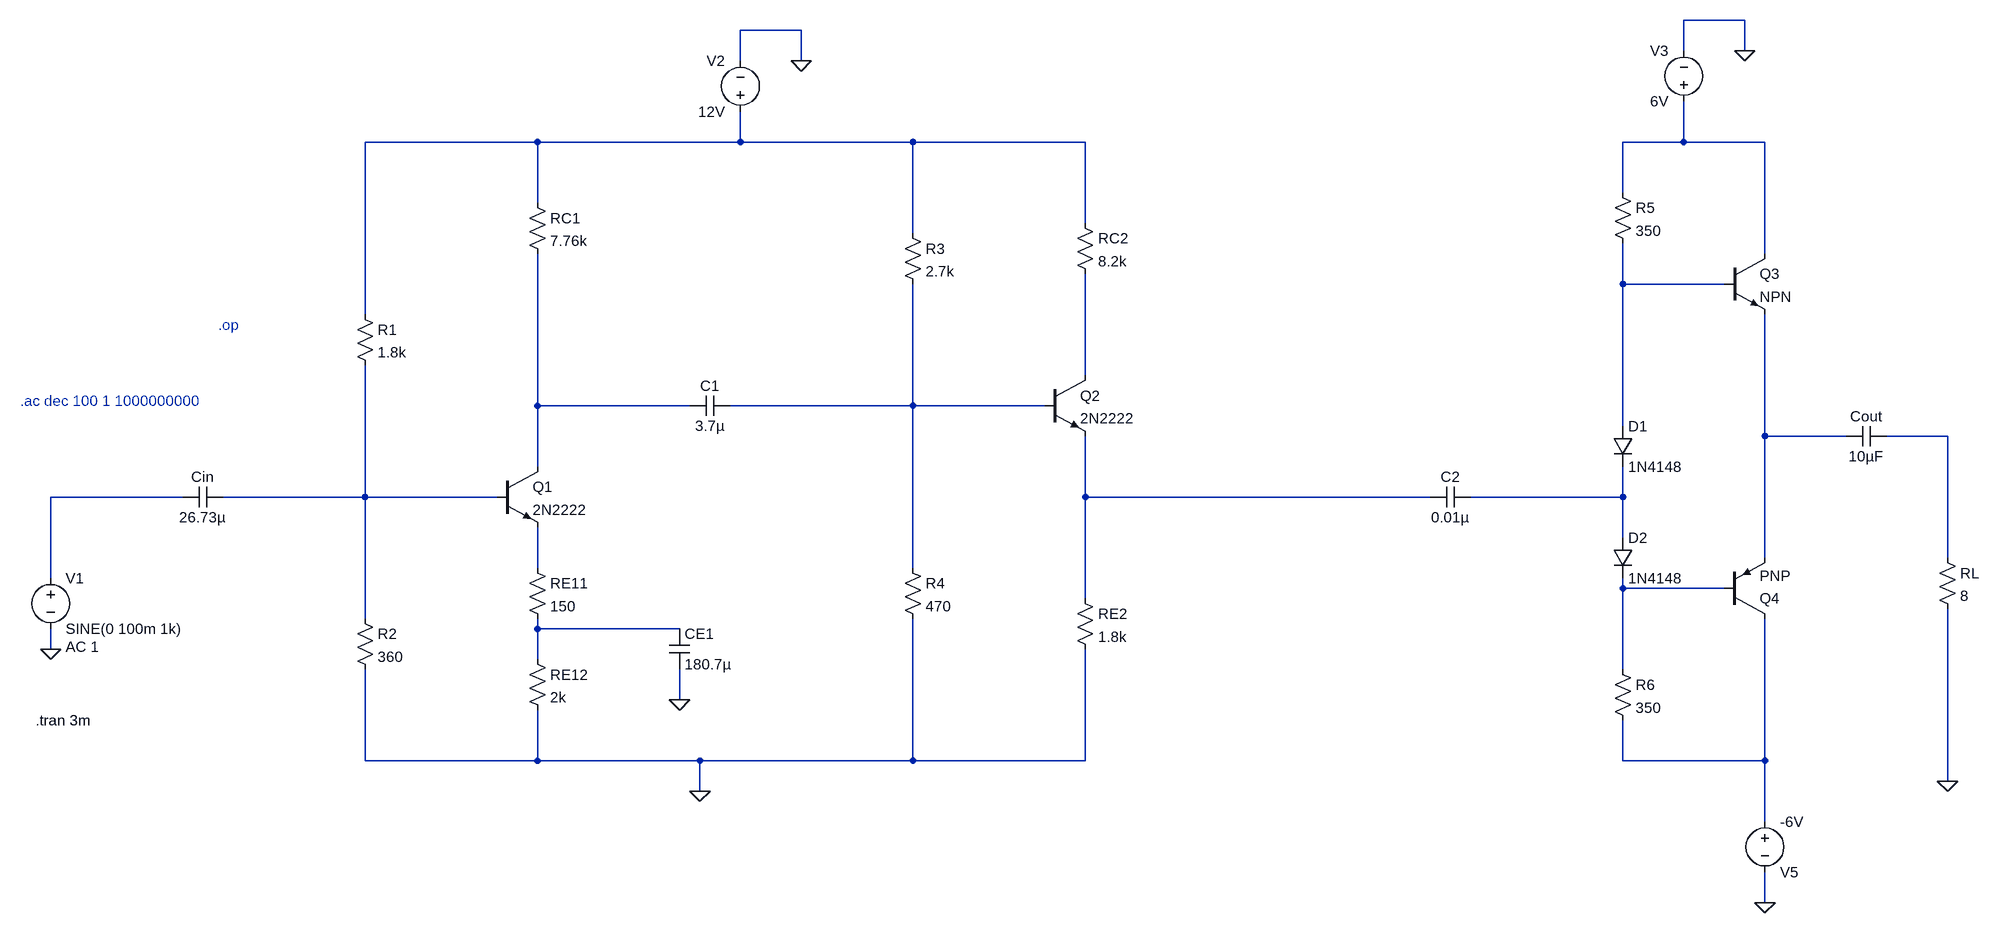
[diagram p0: schematic btlmdt_2stage.asc]
btlmdt_2stage.asc, the LTspice schematic file:
Version 4.1
SHEET 1 4068 680
WIRE 2784 -752 2688 -752
WIRE 1296 -736 1200 -736
WIRE 2688 -704 2688 -752
WIRE 2784 -704 2784 -752
WIRE 1200 -688 1200 -736
WIRE 1296 -688 1296 -736
WIRE 880 -560 608 -560
WIRE 1200 -560 1200 -608
WIRE 1200 -560 880 -560
WIRE 1472 -560 1200 -560
WIRE 1744 -560 1472 -560
WIRE 2688 -560 2688 -624
WIRE 2688 -560 2592 -560
WIRE 2816 -560 2688 -560
WIRE 2592 -480 2592 -560
WIRE 880 -464 880 -560
WIRE 1744 -432 1744 -560
WIRE 1472 -416 1472 -560
WIRE 2816 -384 2816 -560
WIRE 2592 -336 2592 -400
WIRE 2752 -336 2592 -336
WIRE 608 -288 608 -560
WIRE 1744 -192 1744 -352
WIRE 880 -144 880 -384
WIRE 1120 -144 880 -144
WIRE 1472 -144 1472 -336
WIRE 1472 -144 1184 -144
WIRE 1680 -144 1472 -144
WIRE 2592 -112 2592 -336
WIRE 2816 -96 2816 -288
WIRE 2944 -96 2816 -96
WIRE 3104 -96 3008 -96
WIRE 880 -48 880 -144
WIRE 320 0 112 0
WIRE 608 0 608 -208
WIRE 608 0 384 0
WIRE 816 0 608 0
WIRE 1744 0 1744 -96
WIRE 2288 0 1744 0
WIRE 2592 0 2592 -48
WIRE 2592 0 2352 0
WIRE 2592 64 2592 0
WIRE 2816 96 2816 -96
WIRE 3104 96 3104 -96
WIRE 880 112 880 48
WIRE 1472 112 1472 -144
WIRE 112 128 112 0
WIRE 2592 144 2592 128
WIRE 2752 144 2592 144
WIRE 1744 160 1744 0
WIRE 608 192 608 0
WIRE 880 208 880 192
WIRE 1104 208 880 208
WIRE 112 240 112 208
WIRE 880 256 880 208
WIRE 2592 272 2592 144
WIRE 1104 320 1104 272
WIRE 608 416 608 272
WIRE 880 416 880 336
WIRE 880 416 608 416
WIRE 1136 416 880 416
WIRE 1472 416 1472 192
WIRE 1472 416 1136 416
WIRE 1744 416 1744 240
WIRE 1744 416 1472 416
WIRE 2592 416 2592 352
WIRE 2816 416 2816 192
WIRE 2816 416 2592 416
WIRE 3104 448 3104 176
WIRE 1136 464 1136 416
WIRE 2816 512 2816 416
WIRE 2816 640 2816 592
FLAG 1136 464 0
FLAG 1296 -688 0
FLAG 1104 320 0
FLAG 112 240 0
FLAG 2784 -704 0
FLAG 2816 640 0
FLAG 3104 448 0
SYMBOL voltage 112 112 R0
WINDOW 123 24 124 Left 2
WINDOW 39 0 0 Left 0
SYMATTR Value2 AC 1
SYMATTR InstName V1
SYMATTR Value SINE(0 100m 1k)
SYMBOL cap 1088 208 R0
SYMATTR InstName CE1
SYMATTR Value 180.7µ
SYMBOL cap 384 -16 R90
WINDOW 0 0 32 VBottom 2
WINDOW 3 32 32 VTop 2
SYMATTR InstName Cin
SYMATTR Value 26.73µ
SYMBOL res 592 176 R0
SYMATTR InstName R2
SYMATTR Value 360
SYMBOL res 864 -480 R0
SYMATTR InstName RC1
SYMATTR Value 7.76k
SYMBOL res 1456 -432 R0
SYMATTR InstName R3
SYMATTR Value 2.7k
SYMBOL res 592 -304 R0
SYMATTR InstName R1
SYMATTR Value 1.8k
SYMBOL res 1728 -448 R0
SYMATTR InstName RC2
SYMATTR Value 8.2k
SYMBOL res 1728 144 R0
SYMATTR InstName RE2
SYMATTR Value 1.8k
SYMBOL res 1456 96 R0
SYMATTR InstName R4
SYMATTR Value 470
SYMBOL res 864 240 R0
SYMATTR InstName RE12
SYMATTR Value 2k
SYMBOL npn 816 -48 R0
SYMATTR InstName Q1
SYMATTR Value 2N2222
SYMBOL npn 1680 -192 R0
SYMATTR InstName Q2
SYMATTR Value 2N2222
SYMBOL voltage 1200 -592 R180
WINDOW 0 24 96 Left 2
WINDOW 3 24 16 Left 2
WINDOW 123 0 0 Left 0
WINDOW 39 0 0 Left 0
SYMATTR InstName V2
SYMATTR Value 12V
SYMBOL npn 2752 -384 R0
SYMATTR InstName Q3
SYMBOL res 2576 -496 R0
SYMATTR InstName R5
SYMATTR Value 350
SYMBOL res 2576 256 R0
SYMATTR InstName R6
SYMATTR Value 350
SYMBOL res 3088 80 R0
SYMATTR InstName RL
SYMATTR Value 8
SYMBOL pnp 2752 192 M180
SYMATTR InstName Q4
SYMBOL cap 2352 -16 R90
WINDOW 0 0 32 VBottom 2
WINDOW 3 32 32 VTop 2
SYMATTR InstName C2
SYMATTR Value 0.01µ
SYMBOL cap 3008 -112 R90
WINDOW 0 0 32 VBottom 2
WINDOW 3 32 32 VTop 2
SYMATTR InstName Cout
SYMATTR Value 10µF
SYMBOL diode 2576 -112 R0
SYMATTR InstName D1
SYMATTR Value 1N4148
SYMBOL diode 2576 64 R0
SYMATTR InstName D2
SYMATTR Value 1N4148
SYMBOL res 864 96 R0
SYMATTR InstName RE11
SYMATTR Value 150
SYMBOL cap 1184 -160 R90
WINDOW 0 0 32 VBottom 2
WINDOW 3 32 32 VTop 2
SYMATTR InstName C1
SYMATTR Value 3.7µ
SYMBOL voltage 2688 -608 R180
WINDOW 0 24 96 Left 2
WINDOW 3 24 16 Left 2
WINDOW 123 0 0 Left 0
WINDOW 39 0 0 Left 0
SYMATTR InstName V3
SYMATTR Value 6V
SYMBOL voltage 2816 496 R0
WINDOW 0 24 96 Left 2
WINDOW 3 24 16 Left 2
WINDOW 123 0 0 Left 0
WINDOW 39 0 0 Left 0
SYMATTR InstName V5
SYMATTR Value -6V
TEXT 88 352 Left 2 !.tran 3m
TEXT 376 -272 Left 2 ;.op
TEXT 64 -152 Left 2 ;.ac dec 100 1 1000000000

The netlist it stands for:
* btlmdt_2stage.asc
V1 N009 0 SINE(0 100m 1k) AC 1
CE1 N015 0 180.7µ
Cin N010 N009 26.73µ
R2 N010 0 360
RC1 N001 N005 7.76k
R3 N001 N006 2.7k
R1 N001 N010 1.8k
RC2 N001 N004 8.2k
RE2 N011 0 1.8k
R4 N006 0 470
RE12 N015 0 2k
Q1 N005 N010 N013 0 2N2222
Q2 N004 N006 N011 0 2N2222
V2 N001 0 12V
Q3 N002 N003 N007 0 NPN
R5 N002 N003 350
R6 N014 N016 350
RL N008 0 8
Q4 N016 N014 N007 0 PNP
C2 N012 N011 0.01µ
Cout N008 N007 10µF
D1 N003 N012 1N4148
D2 N012 N014 1N4148
RE11 N013 N015 150
C1 N006 N005 3.7µ
V3 N002 0 6V
V5 N016 0 -6V
.model D D
.lib standard.dio
.model NPN NPN
.model PNP PNP
.lib standard.bjt
.tran 3m
* .op
* .ac dec 100 1 1000000000
.backanno
.end